# EAGLE design REV1 (EAGLE 7.5.0)

## Sheet 1 of 4: LEDs Schematic with all the LEDs (Type: WS2812B). There are two seperated data circuits DATA_In_1 and DATA_IN_2 which both have 30 LEDs series-connected.
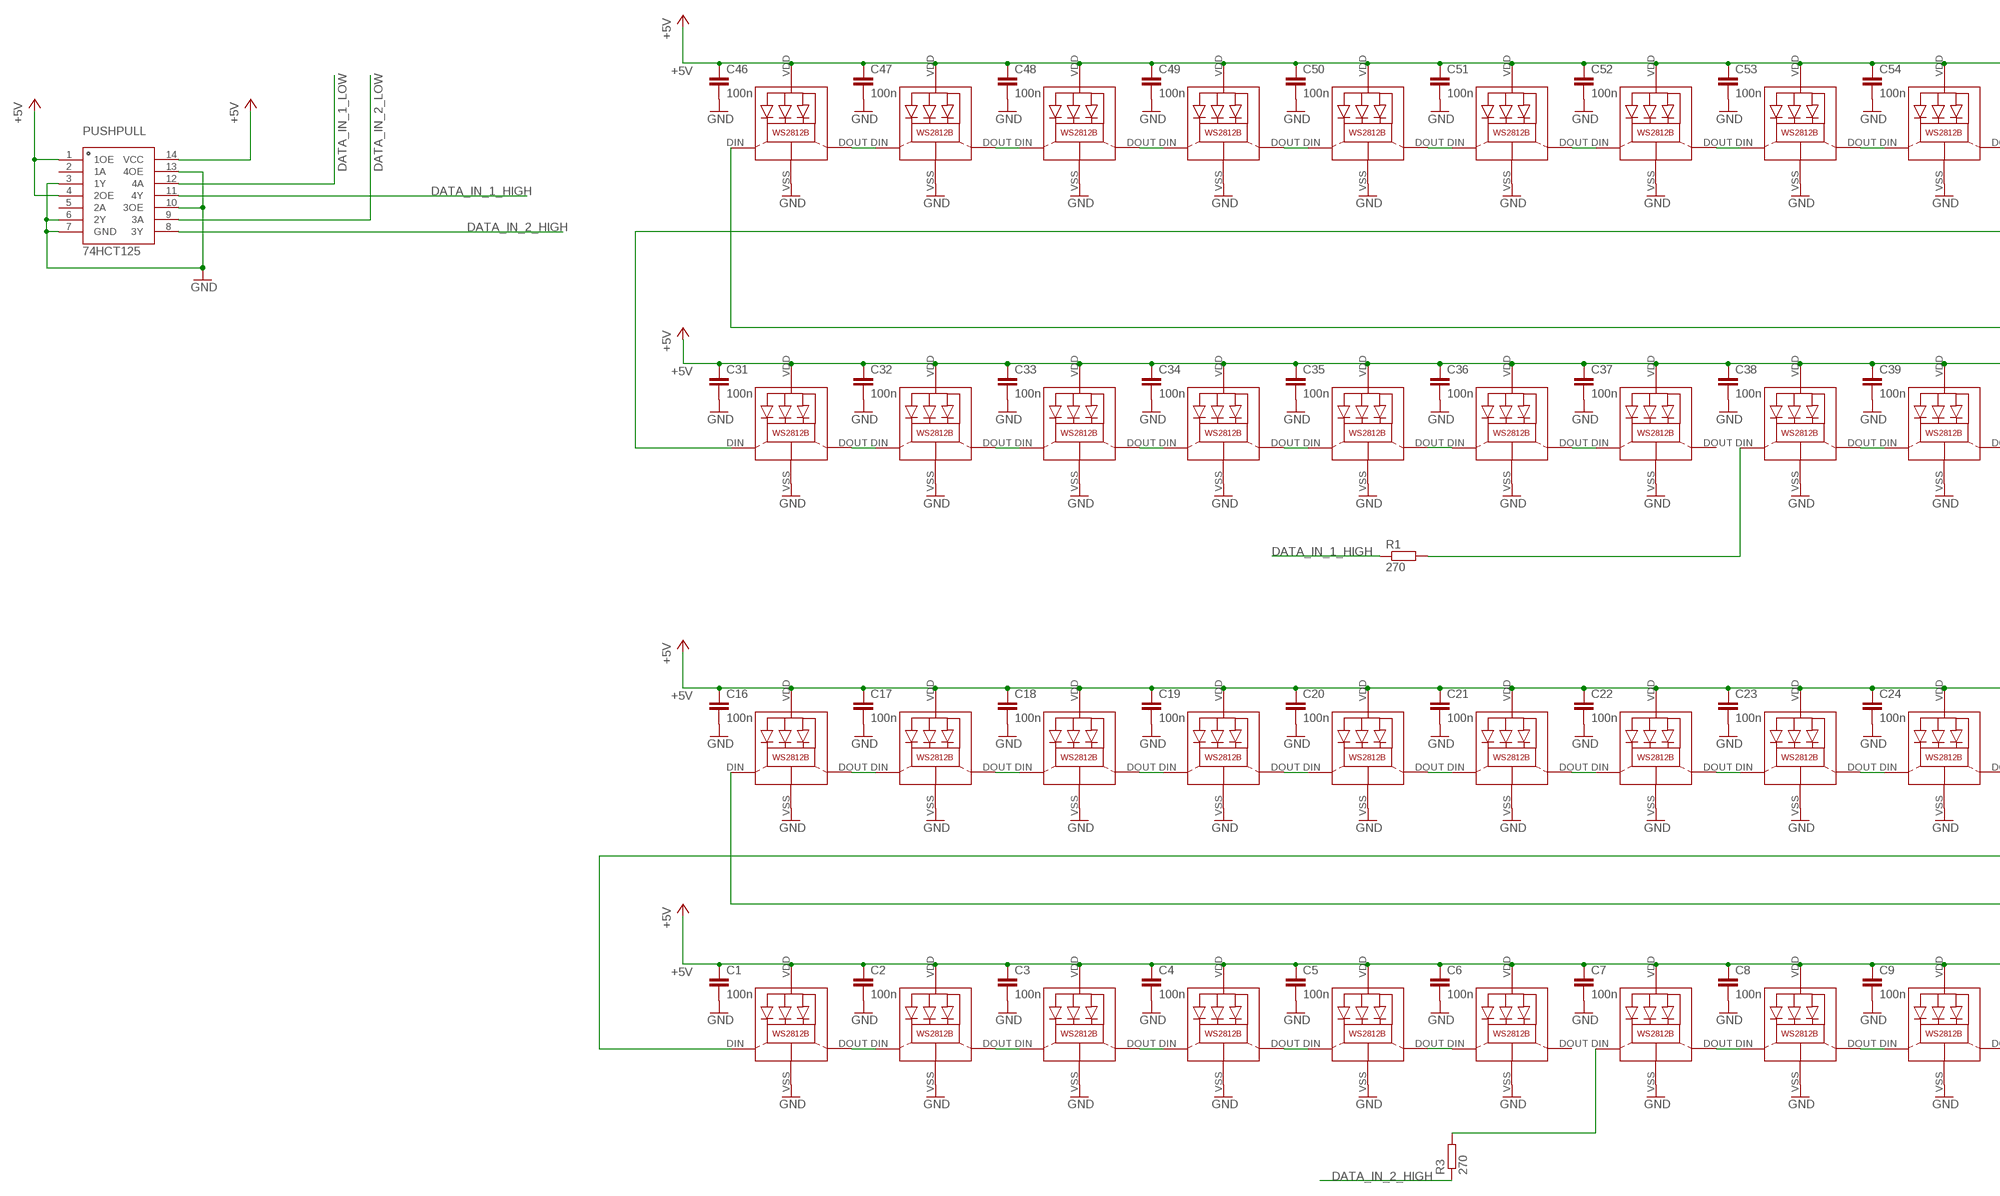
[diagram p0: schematic, sheet 1, part 1 of 2]
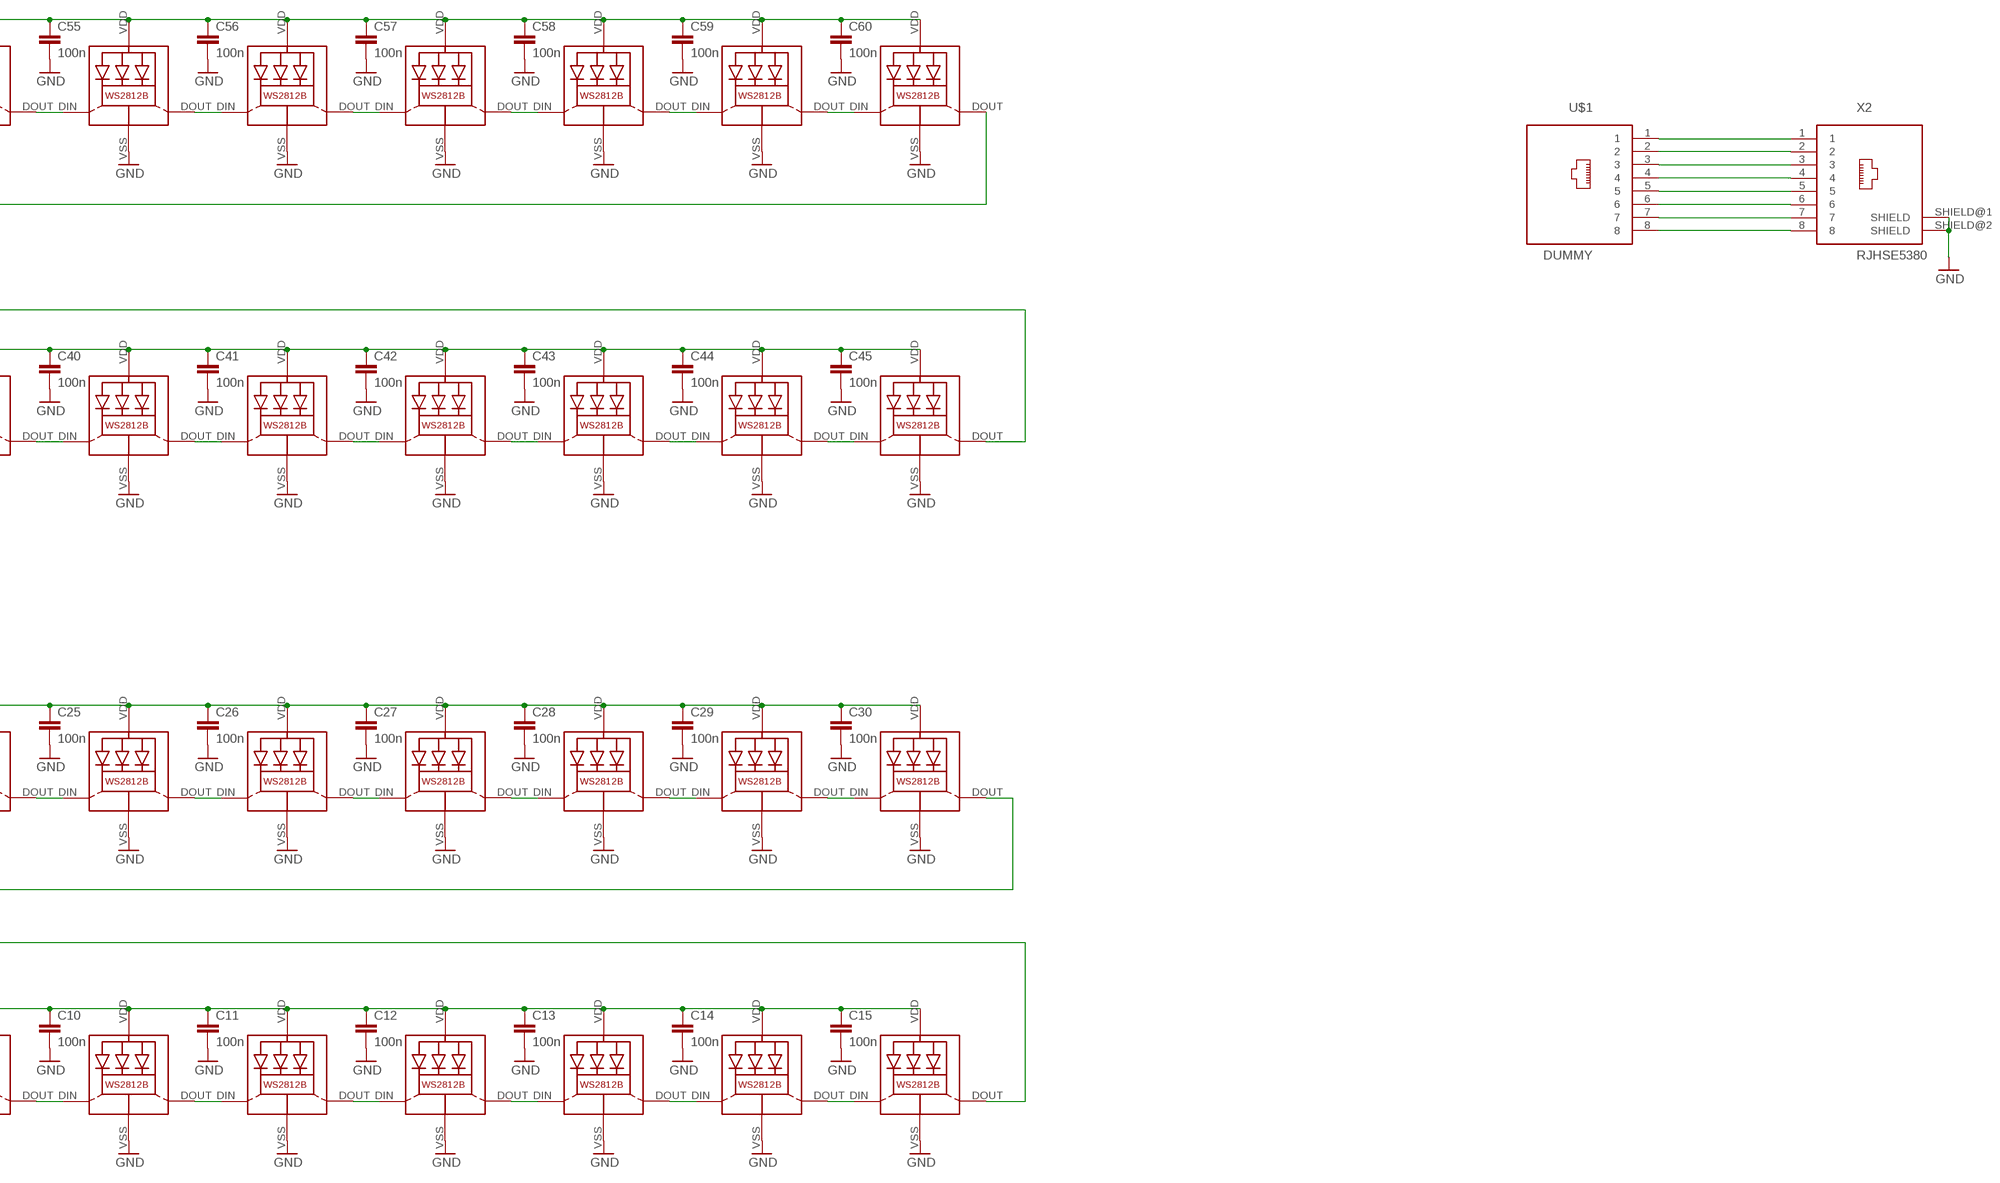
[diagram p1: schematic, sheet 1, part 2 of 2]

### Parts
C1  100n  C-EUC0603  [C0603]
C2  100n  C-EUC0603  [C0603]
C3  100n  C-EUC0603  [C0603]
C4  100n  C-EUC0603  [C0603]
C5  100n  C-EUC0603  [C0603]
C6  100n  C-EUC0603  [C0603]
C7  100n  C-EUC0603  [C0603]
C8  100n  C-EUC0603  [C0603]
C9  100n  C-EUC0603  [C0603]
C10  100n  C-EUC0603  [C0603]
C11  100n  C-EUC0603  [C0603]
C12  100n  C-EUC0603  [C0603]
C13  100n  C-EUC0603  [C0603]
C14  100n  C-EUC0603  [C0603]
C15  100n  C-EUC0603  [C0603]
C16  100n  C-EUC0603  [C0603]
C17  100n  C-EUC0603  [C0603]
C18  100n  C-EUC0603  [C0603]
C19  100n  C-EUC0603  [C0603]
C20  100n  C-EUC0603  [C0603]
C21  100n  C-EUC0603  [C0603]
C22  100n  C-EUC0603  [C0603]
C23  100n  C-EUC0603  [C0603]
C24  100n  C-EUC0603  [C0603]
C25  100n  C-EUC0603  [C0603]
C26  100n  C-EUC0603  [C0603]
C27  100n  C-EUC0603  [C0603]
C28  100n  C-EUC0603  [C0603]
C29  100n  C-EUC0603  [C0603]
C30  100n  C-EUC0603  [C0603]
C31  100n  C-EUC0603  [C0603]
C32  100n  C-EUC0603  [C0603]
C33  100n  C-EUC0603  [C0603]
C34  100n  C-EUC0603  [C0603]
C35  100n  C-EUC0603  [C0603]
C36  100n  C-EUC0603  [C0603]
C37  100n  C-EUC0603  [C0603]
C38  100n  C-EUC0603  [C0603]
C39  100n  C-EUC0603  [C0603]
C40  100n  C-EUC0603  [C0603]
C41  100n  C-EUC0603  [C0603]
C42  100n  C-EUC0603  [C0603]
C43  100n  C-EUC0603  [C0603]
C44  100n  C-EUC0603  [C0603]
C45  100n  C-EUC0603  [C0603]
C46  100n  C-EUC0603  [C0603]
C47  100n  C-EUC0603  [C0603]
C48  100n  C-EUC0603  [C0603]
C49  100n  C-EUC0603  [C0603]
C50  100n  C-EUC0603  [C0603]
C51  100n  C-EUC0603  [C0603]
C52  100n  C-EUC0603  [C0603]
C53  100n  C-EUC0603  [C0603]
C54  100n  C-EUC0603  [C0603]
C55  100n  C-EUC0603  [C0603]
C56  100n  C-EUC0603  [C0603]
C57  100n  C-EUC0603  [C0603]
C58  100n  C-EUC0603  [C0603]
C59  100n  C-EUC0603  [C0603]
C60  100n  C-EUC0603  [C0603]
LED1  WS2812B  [WS2812B]
LED2  WS2812B  [WS2812B]
LED3  WS2812B  [WS2812B]
LED4  WS2812B  [WS2812B]
LED5  WS2812B  [WS2812B]
LED6  WS2812B  [WS2812B]
LED7  WS2812B  [WS2812B]
LED8  WS2812B  [WS2812B]
LED9  WS2812B  [WS2812B]
LED10  WS2812B  [WS2812B]
LED11  WS2812B  [WS2812B]
LED12  WS2812B  [WS2812B]
LED13  WS2812B  [WS2812B]
LED14  WS2812B  [WS2812B]
LED15  WS2812B  [WS2812B]
LED16  WS2812B  [WS2812B]
LED17  WS2812B  [WS2812B]
LED18  WS2812B  [WS2812B]
LED19  WS2812B  [WS2812B]
LED20  WS2812B  [WS2812B]
LED21  WS2812B  [WS2812B]
LED22  WS2812B  [WS2812B]
LED23  WS2812B  [WS2812B]
LED24  WS2812B  [WS2812B]
LED25  WS2812B  [WS2812B]
LED26  WS2812B  [WS2812B]
LED27  WS2812B  [WS2812B]
LED28  WS2812B  [WS2812B]
LED29  WS2812B  [WS2812B]
LED30  WS2812B  [WS2812B]
LED31  WS2812B  [WS2812B]
LED32  WS2812B  [WS2812B]
LED33  WS2812B  [WS2812B]
LED34  WS2812B  [WS2812B]
LED35  WS2812B  [WS2812B]
LED36  WS2812B  [WS2812B]
LED37  WS2812B  [WS2812B]
LED38  WS2812B  [WS2812B]
LED39  WS2812B  [WS2812B]
LED40  WS2812B  [WS2812B]
LED41  WS2812B  [WS2812B]
LED42  WS2812B  [WS2812B]
LED43  WS2812B  [WS2812B]
LED44  WS2812B  [WS2812B]
LED45  WS2812B  [WS2812B]
LED46  WS2812B  [WS2812B]
LED47  WS2812B  [WS2812B]
LED48  WS2812B  [WS2812B]
LED49  WS2812B  [WS2812B]
LED50  WS2812B  [WS2812B]
LED51  WS2812B  [WS2812B]
LED52  WS2812B  [WS2812B]
LED53  WS2812B  [WS2812B]
LED54  WS2812B  [WS2812B]
LED55  WS2812B  [WS2812B]
LED56  WS2812B  [WS2812B]
LED57  WS2812B  [WS2812B]
LED58  WS2812B  [WS2812B]
LED59  WS2812B  [WS2812B]
LED60  WS2812B  [WS2812B]
PUSHPULL  74HCT125  [SO-14DW]
R1  270  R-EU_R0603  [R0603]
R3  270  R-EU_R0603  [R0603]
U$1  DUMMY  [DUMMY]
X2  RJHSE5380  [RJHSE5380]

### Nets
+5V: C1.1 C2.1 C3.1 C4.1 C5.1 C6.1 C7.1 C8.1 C9.1 C10.1 C11.1 C12.1 C13.1 C14.1 C15.1 C16.1 C17.1 C18.1 C19.1 C20.1 C21.1 C22.1 C23.1 C24.1 C25.1 C26.1 C27.1 C28.1 C29.1 C30.1 C31.1 C32.1 C33.1 C34.1 C35.1 C36.1 C37.1 C38.1 C39.1 C40.1 C41.1 C42.1 C43.1 C44.1 C45.1 C46.1 C47.1 C48.1 C49.1 C50.1 C51.1 C52.1 C53.1 C54.1 C55.1 C56.1 C57.1 C58.1 C59.1 C60.1 LED1.VDD LED2.VDD LED3.VDD LED4.VDD LED5.VDD LED6.VDD LED7.VDD LED8.VDD LED9.VDD LED10.VDD LED11.VDD LED12.VDD LED13.VDD LED14.VDD LED15.VDD LED16.VDD LED17.VDD LED18.VDD LED19.VDD LED20.VDD LED21.VDD LED22.VDD LED23.VDD LED24.VDD LED25.VDD LED26.VDD LED27.VDD LED28.VDD LED29.VDD LED30.VDD LED31.VDD LED32.VDD LED33.VDD LED34.VDD LED35.VDD LED36.VDD LED37.VDD LED38.VDD LED39.VDD LED40.VDD LED41.VDD LED42.VDD LED43.VDD LED44.VDD LED45.VDD LED46.VDD LED47.VDD LED48.VDD LED49.VDD LED50.VDD LED51.VDD LED52.VDD LED53.VDD LED54.VDD LED55.VDD LED56.VDD LED57.VDD LED58.VDD LED59.VDD LED60.VDD PUSHPULL.1(1OE) PUSHPULL.4(2OE) PUSHPULL.14(VCC) ; also sheet 2
DATA_IN_1_HIGH: PUSHPULL.11(4Y) R1.1
DATA_IN_1_LOW: PUSHPULL.12(4A) ; also sheet 3
DATA_IN_2_HIGH: PUSHPULL.8(3Y) R3.1
DATA_IN_2_LOW: PUSHPULL.9(3A) ; also sheet 3
GND: C1.2 C2.2 C3.2 C4.2 C5.2 C6.2 C7.2 C8.2 C9.2 C10.2 C11.2 C12.2 C13.2 C14.2 C15.2 C16.2 C17.2 C18.2 C19.2 C20.2 C21.2 C22.2 C23.2 C24.2 C25.2 C26.2 C27.2 C28.2 C29.2 C30.2 C31.2 C32.2 C33.2 C34.2 C35.2 C36.2 C37.2 C38.2 C39.2 C40.2 C41.2 C42.2 C43.2 C44.2 C45.2 C46.2 C47.2 C48.2 C49.2 C50.2 C51.2 C52.2 C53.2 C54.2 C55.2 C56.2 C57.2 C58.2 C59.2 C60.2 LED1.VSS(GND) LED2.VSS(GND) LED3.VSS(GND) LED4.VSS(GND) LED5.VSS(GND) LED6.VSS(GND) LED7.VSS(GND) LED8.VSS(GND) LED9.VSS(GND) LED10.VSS(GND) LED11.VSS(GND) LED12.VSS(GND) LED13.VSS(GND) LED14.VSS(GND) LED15.VSS(GND) LED16.VSS(GND) LED17.VSS(GND) LED18.VSS(GND) LED19.VSS(GND) LED20.VSS(GND) LED21.VSS(GND) LED22.VSS(GND) LED23.VSS(GND) LED24.VSS(GND) LED25.VSS(GND) LED26.VSS(GND) LED27.VSS(GND) LED28.VSS(GND) LED29.VSS(GND) LED30.VSS(GND) LED31.VSS(GND) LED32.VSS(GND) LED33.VSS(GND) LED34.VSS(GND) LED35.VSS(GND) LED36.VSS(GND) LED37.VSS(GND) LED38.VSS(GND) LED39.VSS(GND) LED40.VSS(GND) LED41.VSS(GND) LED42.VSS(GND) LED43.VSS(GND) LED44.VSS(GND) LED45.VSS(GND) LED46.VSS(GND) LED47.VSS(GND) LED48.VSS(GND) LED49.VSS(GND) LED50.VSS(GND) LED51.VSS(GND) LED52.VSS(GND) LED53.VSS(GND) LED54.VSS(GND) LED55.VSS(GND) LED56.VSS(GND) LED57.VSS(GND) LED58.VSS(GND) LED59.VSS(GND) LED60.VSS(GND) PUSHPULL.3(1Y) PUSHPULL.6(2Y) PUSHPULL.7(GND) PUSHPULL.10(3OE) PUSHPULL.13(4OE) X2.SHIELD@1(SHIELD) X2.SHIELD@2(SHIELD) ; also sheet 2,3,4
N$1: LED45.DOUT(DO) LED46.DIN(DI)
N$2: LED46.DOUT(DO) LED47.DIN(DI)
N$3: LED47.DOUT(DO) LED48.DIN(DI)
N$4: LED48.DOUT(DO) LED49.DIN(DI)
N$5: LED49.DOUT(DO) LED50.DIN(DI)
N$6: LED50.DOUT(DO) LED51.DIN(DI)
N$7: LED51.DOUT(DO) LED52.DIN(DI)
N$8: LED52.DOUT(DO) LED53.DIN(DI)
N$9: LED53.DOUT(DO) LED54.DIN(DI)
N$10: LED54.DOUT(DO) LED55.DIN(DI)
N$11: LED55.DOUT(DO) LED56.DIN(DI)
N$12: LED56.DOUT(DO) LED57.DIN(DI)
N$13: LED57.DOUT(DO) LED58.DIN(DI)
N$14: LED58.DOUT(DO) LED59.DIN(DI)
N$15: LED59.DOUT(DO) LED60.DIN(DI)
N$16: LED31.DIN(DI) LED60.DOUT(DO)
N$17: LED1.DIN(DI) LED30.DOUT(DO)
N$18: LED1.DOUT(DO) LED2.DIN(DI)
N$19: LED2.DOUT(DO) LED3.DIN(DI)
N$20: LED3.DOUT(DO) LED4.DIN(DI)
N$21: LED4.DOUT(DO) LED5.DIN(DI)
N$22: LED7.DIN(DI) R3.2
N$23: LED5.DOUT(DO) LED6.DIN(DI)
N$24: LED7.DOUT(DO) LED8.DIN(DI)
N$25: LED8.DOUT(DO) LED9.DIN(DI)
N$26: LED9.DOUT(DO) LED10.DIN(DI)
N$27: LED10.DOUT(DO) LED11.DIN(DI)
N$28: LED11.DOUT(DO) LED12.DIN(DI)
N$29: LED12.DOUT(DO) LED13.DIN(DI)
N$30: LED13.DOUT(DO) LED14.DIN(DI)
N$31: LED14.DOUT(DO) LED15.DIN(DI)
N$32: LED15.DOUT(DO) LED16.DIN(DI)
N$33: LED16.DOUT(DO) LED17.DIN(DI)
N$34: LED17.DOUT(DO) LED18.DIN(DI)
N$35: LED18.DOUT(DO) LED19.DIN(DI)
N$36: LED19.DOUT(DO) LED20.DIN(DI)
N$37: LED20.DOUT(DO) LED21.DIN(DI)
N$38: LED21.DOUT(DO) LED22.DIN(DI)
N$39: LED22.DOUT(DO) LED23.DIN(DI)
N$40: LED23.DOUT(DO) LED24.DIN(DI)
N$41: LED24.DOUT(DO) LED25.DIN(DI)
N$42: LED25.DOUT(DO) LED26.DIN(DI)
N$43: LED26.DOUT(DO) LED27.DIN(DI)
N$44: LED27.DOUT(DO) LED28.DIN(DI)
N$45: LED28.DOUT(DO) LED29.DIN(DI)
N$46: LED29.DOUT(DO) LED30.DIN(DI)
N$47: LED38.DIN(DI) R1.2
N$48: LED31.DOUT(DO) LED32.DIN(DI)
N$49: LED32.DOUT(DO) LED33.DIN(DI)
N$50: LED33.DOUT(DO) LED34.DIN(DI)
N$51: LED34.DOUT(DO) LED35.DIN(DI)
N$52: LED35.DOUT(DO) LED36.DIN(DI)
N$53: LED36.DOUT(DO) LED37.DIN(DI)
N$54: U$1.1 X2.1
N$55: LED38.DOUT(DO) LED39.DIN(DI)
N$56: LED39.DOUT(DO) LED40.DIN(DI)
N$57: LED40.DOUT(DO) LED41.DIN(DI)
N$58: LED41.DOUT(DO) LED42.DIN(DI)
N$59: LED42.DOUT(DO) LED43.DIN(DI)
N$60: LED43.DOUT(DO) LED44.DIN(DI)
N$61: LED44.DOUT(DO) LED45.DIN(DI)
N$62: U$1.2 X2.2
N$64: U$1.3 X2.3
N$70: U$1.4 X2.4
N$73: U$1.5 X2.5
N$74: U$1.6 X2.6
N$75: U$1.7 X2.7
N$79: U$1.8 X2.8
Unconnected: LED6.DOUT(DO) LED37.DOUT(DO) PUSHPULL.2(1A) PUSHPULL.5(2A)

## Sheet 2 of 4: Power Management Power Management with LTC4412 for auto selection of USB supply or external power supply. LTC4412 controls two mosfets. Diode for overvoltage protection of the USB port.
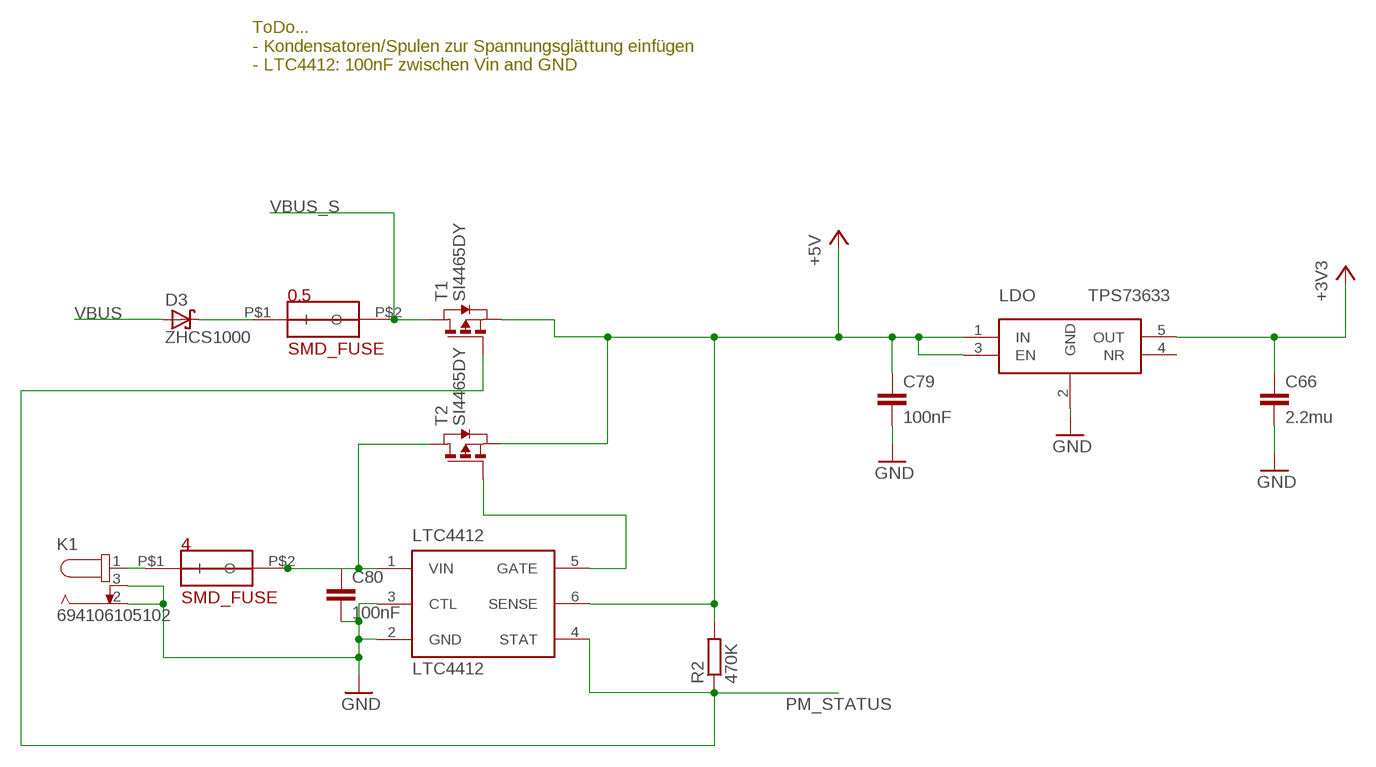
[diagram p2: schematic, sheet 2]

### Parts
0.5  SMD_FUSE  [FUSE]
4  SMD_FUSE  [FUSE]
C66  2.2mu  C-EUC0603  [C0603]
C79  100nF  C-EUC0603  [C0603]
C80  100nF  C-EUC0603  [C0603]
D3  ZHCS1000  [SOT23]
K1  694106105102  [694106105102]
LDO  TPS73633  [SOT23-DBV]
LTC4412  LTC4412  [SOT23-6L]
R2  470K  R-EU_R0603  [R0603]
T1  SI4465DY  PMOSSOT223SO8  [SO08]
T2  SI4465DY  PMOSSOT223SO8  [SO08]

### Nets
+3V3: C66.1 LDO.5(OUT) ; also sheet 3
+5V: C79.1 LDO.1(IN) LDO.3(EN) LTC4412.6(SENSE) R2.2 T1.1(S) T1.2(S) T1.3(S) T2.1(S) T2.2(S) T2.3(S) ; also sheet 1
GND: C66.2 C79.2 C80.2 K1.2 K1.3 LDO.2(GND) LTC4412.2(GND) LTC4412.3(CTL) ; also sheet 1,3,4
N$63: LTC4412.5(GATE) T2.4(G)
N$69: 0.5.P$1(I) D3.1(C)
PM_STATUS: LTC4412.4(STAT) R2.1 T1.4(G) ; also sheet 3
V_5: 4.P$2(O) C80.1 LTC4412.1(VIN) T2.5(D) T2.6(D) T2.7(D) T2.8(D)
V_IN: 4.P$1(I) K1.1
VBUS: D3.3(A) ; also sheet 4
VBUS_S: 0.5.P$2(O) T1.5(D) T1.6(D) T1.7(D) T1.8(D) ; also sheet 4
Unconnected: LDO.4(NR)

### Notes on the sheet
- ToDo...
  - Kondensatoren/Spulen zur Spannungsglättung einfügen
  - LTC4412: 100nF zwischen Vin and GND

## Sheet 3 of 4: MCU A STM32745VE is used as a microcontroller
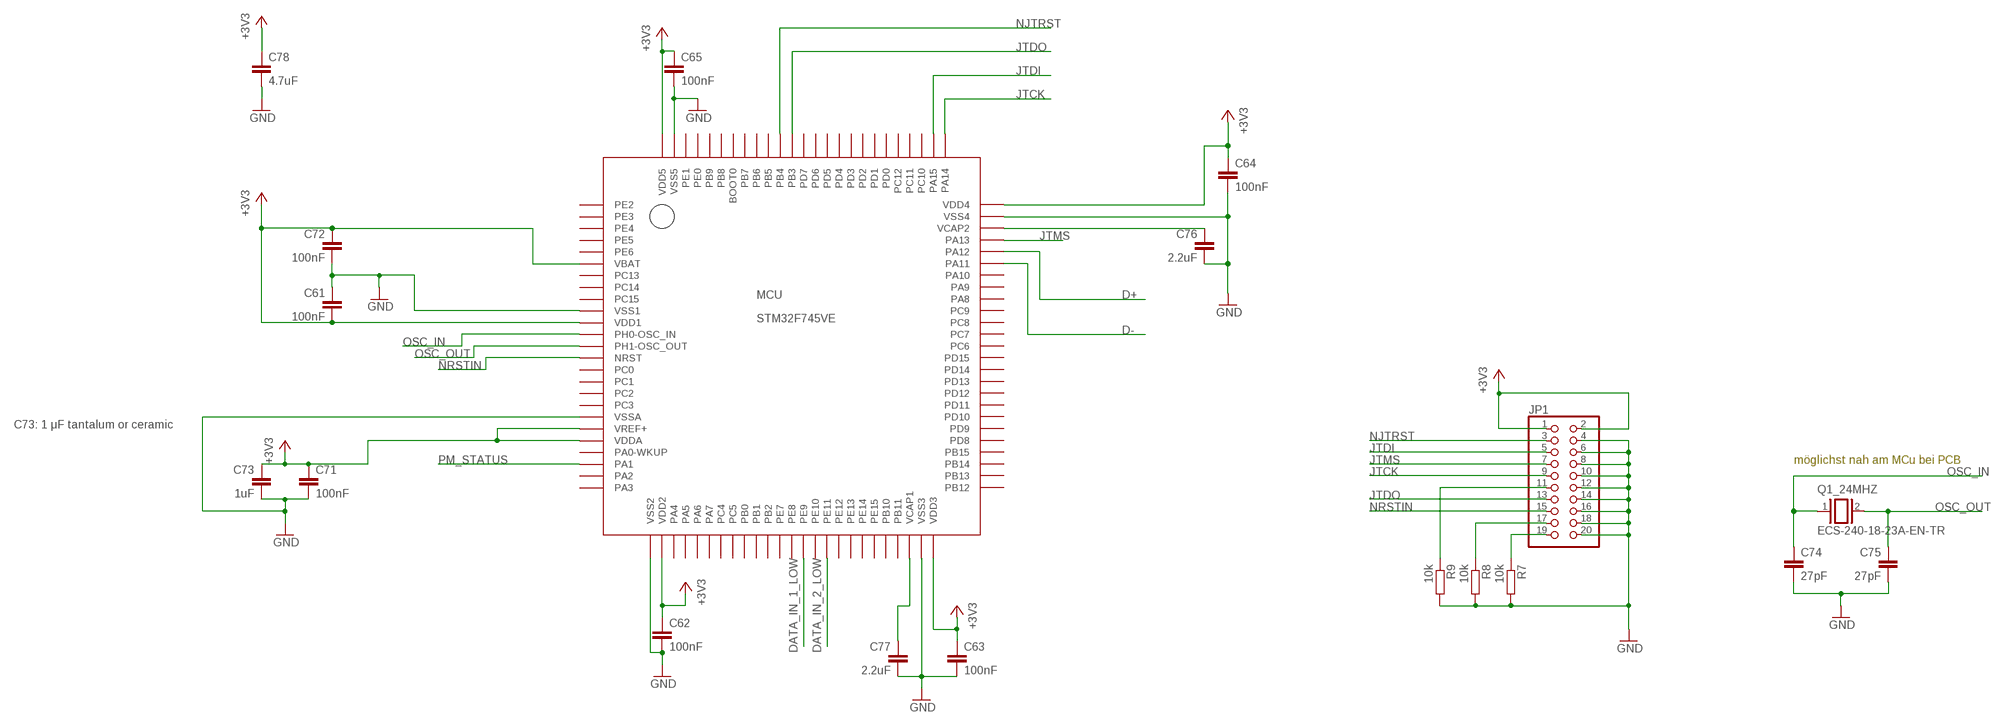
[diagram p3: schematic, sheet 3]

### Parts
C61  100nF  C-EUC0603  [C0603]
C62  100nF  C-EUC0603  [C0603]
C63  100nF  C-EUC0603  [C0603]
C64  100nF  C-EUC0603  [C0603]
C65  100nF  C-EUC0603  [C0603]
C71  100nF  C-EUC0603  [C0603]
C72  100nF  C-EUC0603  [C0603]
C73  1uF  C-EUC0603  [C0603]
C74  27pF  C-EUC0603  [C0603]
C75  27pF  C-EUC0603  [C0603]
C76  2.2uF  C-EUC0603  [C0603]
C77  2.2uF  C-EUC0603  [C0603]
C78  4.7uF  C-EUC0603  [C0603]
JP1  PINHD-2X10_2.54-SMD  [2X10SMD]
MCU  STM32F745VE  [LQFP100]
Q1_24MHZ  ECS-240-18-23A-EN-TR  ECX64A  [ESC64A]
R7  10k  R-EU_R0603  [R0603]
R8  10k  R-EU_R0603  [R0603]
R9  10k  R-EU_R0603  [R0603]

### Nets
+3V3: C61.2 C62.1 C63.1 C64.1 C65.1 C71.1 C72.1 C73.1 C78.1 JP1.1 JP1.2 MCU.6(VBAT) MCU.11(VDD1) MCU.20(VREF+) MCU.21(VDDA) MCU.27(VDD2) MCU.50(VDD3) MCU.75(VDD4) MCU.100(VDD5) ; also sheet 2
D+: MCU.71(PA12) ; also sheet 4
D-: MCU.70(PA11) ; also sheet 4
DATA_IN_1_LOW: MCU.39(PE9) ; also sheet 1
DATA_IN_2_LOW: MCU.41(PE11) ; also sheet 1
GND: C61.1 C62.2 C63.2 C64.2 C65.2 C71.2 C72.2 C73.2 C74.2 C75.2 C76.2 C77.2 C78.2 JP1.4 JP1.6 JP1.8 JP1.10 JP1.12 JP1.14 JP1.16 JP1.18 JP1.20 MCU.10(VSS1) MCU.19(VSSA) MCU.26(VSS2) MCU.49(VSS3) MCU.74(VSS4) MCU.99(VSS5) R7.2 R8.2 R9.2 ; also sheet 1,2,4
JTCK: JP1.9 MCU.76(PA14)
JTDI: JP1.5 MCU.77(PA15)
JTDO: JP1.13 MCU.89(PB3)
JTMS: JP1.7 MCU.72(PA13)
N$71: C77.1 MCU.48(VCAP1)
N$72: C76.1 MCU.73(VCAP2)
N$76: JP1.19 R7.1
N$77: JP1.17 R8.1
N$78: JP1.11 R9.1
NJTRST: JP1.3 MCU.90(PB4)
NRSTIN: JP1.15 MCU.14(NRST)
OSC_IN: C74.1 MCU.12(PH0-OSC_IN) Q1_24MHZ.1
OSC_OUT: C75.1 MCU.13(PH1-OSC_OUT) Q1_24MHZ.2
PM_STATUS: MCU.23(PA1) ; also sheet 2
Unconnected: MCU.1(PE2) MCU.2(PE3) MCU.3(PE4) MCU.4(PE5) MCU.5(PE6) MCU.7(PC13) MCU.8(PC14) MCU.9(PC15) MCU.15(PC0) MCU.16(PC1) MCU.17(PC2) MCU.18(PC3) MCU.22(PA0-WKUP) MCU.24(PA2) MCU.25(PA3) MCU.28(PA4) MCU.29(PA5) MCU.30(PA6) MCU.31(PA7) MCU.32(PC4) MCU.33(PC5) MCU.34(PB0) MCU.35(PB1) MCU.36(PB2) MCU.37(PE7) MCU.38(PE8) MCU.40(PE10) MCU.42(PE12) MCU.43(PE13) MCU.44(PE14) MCU.45(PE15) MCU.46(PB10) MCU.47(PB11) MCU.51(PB12) MCU.52(PB13) MCU.53(PB14) MCU.54(PB15) MCU.55(PD8) MCU.56(PD9) MCU.57(PD10) MCU.58(PD11) MCU.59(PD12) MCU.60(PD13) MCU.61(PD14) MCU.62(PD15) MCU.63(PC6) MCU.64(PC7) MCU.65(PC8) MCU.66(PC9) MCU.67(PA8) MCU.68(PA9) MCU.69(PA10) MCU.78(PC10) MCU.79(PC11) MCU.80(PC12) MCU.81(PD0) MCU.82(PD1) MCU.83(PD2) MCU.84(PD3) MCU.85(PD4) MCU.86(PD5) MCU.87(PD6) MCU.88(PD7) MCU.91(PB5) MCU.92(PB6) MCU.93(PB7) MCU.94(BOOT0) MCU.95(PB8) MCU.96(PB9) MCU.97(PE0) MCU.98(PE1)

### Notes on the sheet
- C73: 1 μF tantalum or ceramic
- möglichst nah am MCu bei PCB

## Sheet 4 of 4: USB USB-Connection
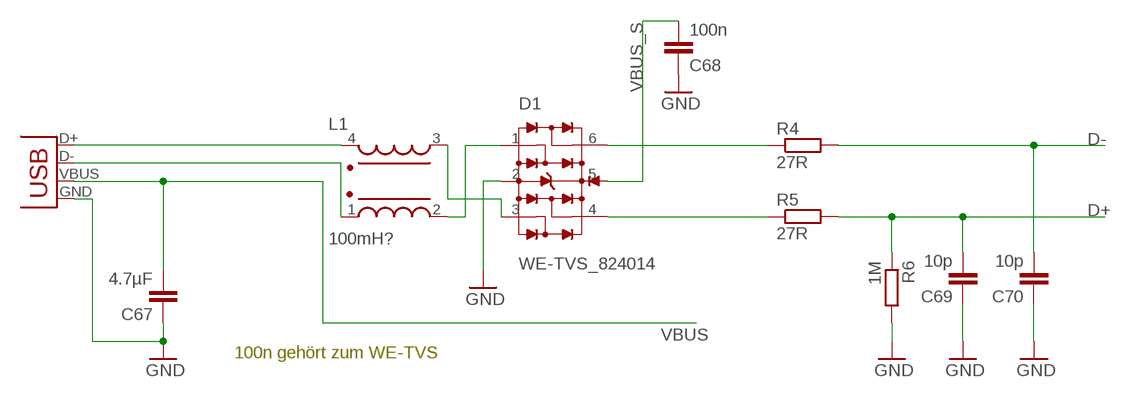
[diagram p4: schematic, sheet 4]

### Parts
C67  4.7µF  C-EUC0603  [C0603]
C68  100n  C-EUC0603  [C0603]
C69  10p  C-EUC0603  [C0603]
C70  10p  C-EUC0603  [C0603]
D1  WE-TVS_824014  [WE-TVS_SOT23-6L]
L1  100mH?  WE-CNSW_0805  [WE-CNSW_0805]
R4  27R  R-EU_R0603  [R0603]
R5  27R  R-EU_R0603  [R0603]
R6  1M  R-EU_R0603  [R0603]
X1  USBSMD  [USB-MINIB]

### Nets
D+: C69.2 R5.2 R6.1 ; also sheet 3
D+_TMP: L1.4 X1.D+
D-: C70.2 R4.2 ; also sheet 3
D-_TMP: L1.1 X1.D-
GND: C67.1 C68.1 C69.1 C70.1 D1.2(GND) R6.2 X1.GND ; also sheet 1,2,3
N$65: D1.1 L1.2
N$66: D1.3 L1.3
N$67: D1.6 R4.1
N$68: D1.4 R5.1
VBUS: C67.2 X1.VBUS ; also sheet 2
VBUS_S: C68.2 D1.5(VDD) ; also sheet 2

### Notes on the sheet
- 100n gehört zum WE-TVS

## Library data of the parts
0.5 4 = ownLib:SMD_FUSE
C1-C80 = rcl:C-EU: CAPACITOR, European symbol
D1 = Wurth_Elektronik_EMC_COMPONENTS_rev16c:WE-TVS_824014: TVS Diode Super Speed Series Characteristics Operating temperature: –55 ºC to +85 °C for 824 014 x; –40 ºC to +85 °C for 824 016 46 Low clamping voltage Very low capacitance Rail to Rail protection Epoxy flame resistant UL94 V-0 RoHS, REACH and free of halogens Applications Super Speed data lines HDMI 1.3/1.4, DVI DisplayPort USB 3.0 SuperSpeed SATA GBit LAN ESD protection in accordance with EN 61000-4-2 – 8 kV contact discharge – 15 kV air discharge <http://katalog.we-online.de/media/images/eisos/VarTVS_highspeed_pf2.jpg.jpg> Details see: http://katalog.we-online.de/en/pbs/WE-TVS_High_Speed/24014? Updated by Dan Xu 2014-07-11 2014 (C) Wurth Elektronik
D3 = ownLib:ZHCS1000: Silicon Schottky Diodes General-purpose diode for high-speed switching
JP1 = pinhead:PINHD-2X10: PIN HEADER
K1 = Wurth_Elektronik_Electromechanic_DC_Power_Jack_Connectors_rev15c:694106105102: WR-DC_DC Power Jack_Right Angled_SMT Center Pin Ø2.0_Plug ID Ø2.05_Plug OD Ø5.5_with Peg ;=>Code : Con_WR-DC_SMT_694106105102_694106105102 <http://katalog.we-online.de/media/images/eican/Con_WR-DC_SMT_694106105102_pf2.jpg> Details see: http://katalog.we-online.de/em/datasheet/6941xx105102.pdf Created 2014-10-08, Karrer Zheng 2014 (C) Wurth Elektronik
L1 = Wurth_Elektronik_EMC_COMPONENTS_rev16c:WE-CNSW: WE-CNSW SMD Common Mode Line Filter Characteristics High common mode noise suppression at high frequencies Small influence on high speed signals through winding symmetry Operating temperature: –40 ºC to +125 ºC (Size 0805/1206/1812); –40 ºC to +105 ºC (Size 0603) Applications USB 2.0 IEEE 1394 (Firewire) LVDS High Speed Data Lines LAN <http://katalog.we-online.de/media/images/eisos/IndCNSW_pf2.jpg> Details see: http://katalog.we-online.de/en/pbs/WE-CNSW Updated by Dan Xu 2014-06-30 2014 (C) Wurth Elektronik
LDO = TPS73633:TPS73633
LED1-LED60 = WS2812B:WS2812B: Features and Benefits  * Intelligent reverse connect protection, the power supply reverse connection does not damage the IC. * The control circuit and the LED share the only power source. Control circuit and RGB chip are integrated in a package of 5050 components, form a complete control of pixel point.  * Built-in signal reshaping circuit, after wave reshaping to the next driver, ensure wave-form distortion not accumulate.  * Built-in electric reset circuit and power lost reset circuit.  * Each pixel of the three primary color can achieve 256 brightness display, completed 16777216 color full color display, and scan frequency not less than 400Hz/s.  * Cascading port transmission signal by single line.  * Any two point the distance more than 5m transmission signal without any increase circuit.  * When the refresh rate is 30fps, cascade number are not less than1024 points.  * Send data at speeds of 800Kbps.  *The color of the light were highly consistent, cost-effective. Applications  Full-color module, Full color soft lights a lamp strip. LED decorative lighting, Indoor/outdoor LED video irregular screen. General description WS2812B is a intelligent control LED light source that the control circuit and RGB chip are integrated in a package of 5050 components. It internal include intelligent digital port data latch and signal reshaping amplification drive circuit. Also include a precision internal oscillator and a 12V voltage programmable constant curre-nt control part, effectively ensuring the pixel point light color height consistent. The data transfer protocol use single NZR communication mode. After the pixel power-on reset, the DIN port receive data from controller, the first pixel collect initial 24bit data then sent to the internal data latch, the other data which reshaping by the internal signal reshaping amplification circuit sent to the next cascade pixel through the DO port. After transmission for each pixel,the signal to reduce 24bit. pixel adopt auto reshaping transmit technology, making the pixel cascade number is not limited the signal transmission, only depend on the speed of signal transmission. LED with low driving voltage, environmental protection and energy saving, high brightness, scattering angle is large, good consistency, low power, long life and other advantages. The control chip integrated in LED above becoming more simple circuit, small volume, convenient installation. Absolute Maximum Ratings Power supply voltage: VDD +3.5V..+5.3V Input voltage: VI -0.5V..VDD+0.5V based on WS2812 from https://github.com/adafruit/Adafruit-Eagle-Library
LTC4412 = LTC4412:LTC4412
MCU = STM32F745VE_LQFP100:STM32F745VE
PUSHPULL = 74HCT125:74HCT125
Q1_24MHZ = Crystal:ECX64A: CRYSTAL
R1-R9 = rcl:R-EU_: RESISTOR, European symbol
T1 T2 = ownLib:PMOSSOT223: MOS FET
U$1 = lan_connector:DUMMY
X1 = usb:USB: USB Connectors USB-B-PTH is fully proven SKU : PRT-00139 USB-miniB is fully proven SKU : PRT-00587 USB-A-PCB is untested. USB-A-H is throughly reviewed, but untested. Spark Fun Electronics SKU : PRT-00437 USB-B-SMT is throughly reviewed, but untested. Needs silkscreen touching up. USB-A-S has not been used/tested USB-MB-H has not been used/tested
X2 = lan_connector:RJHSE5380

## Board
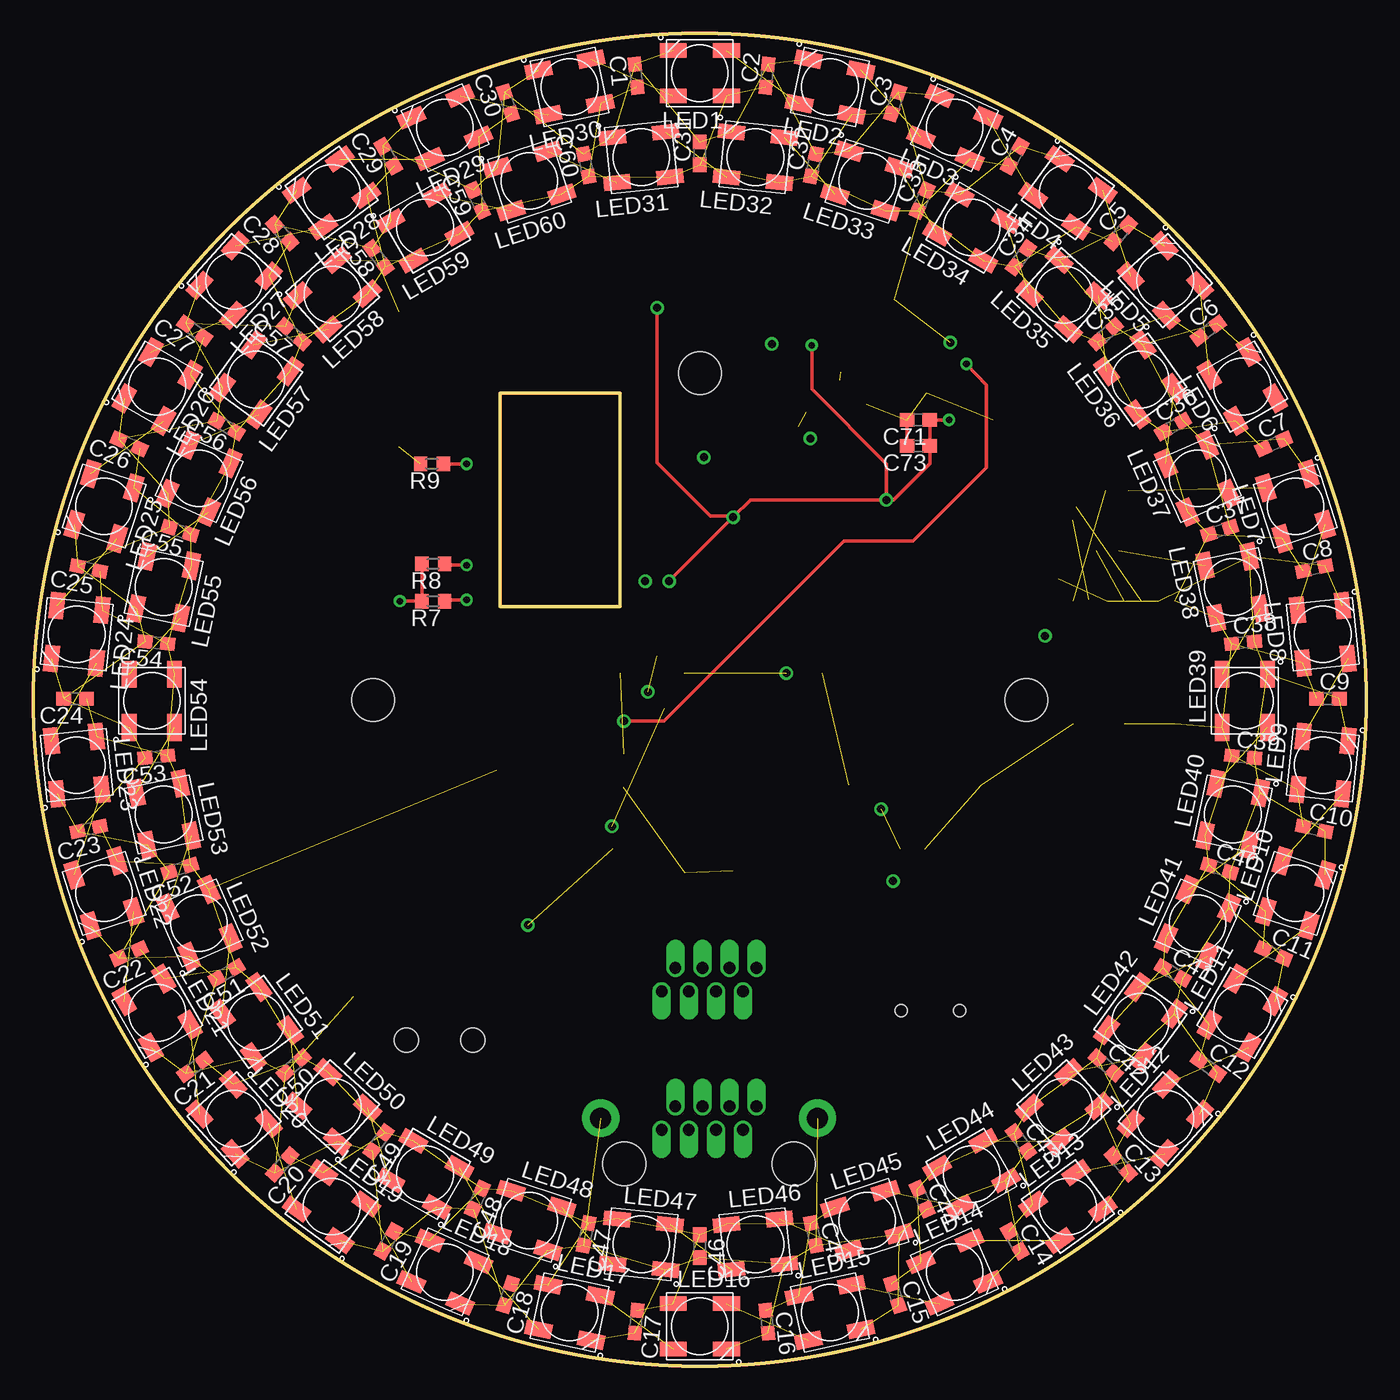
[diagram p5: board, top side]
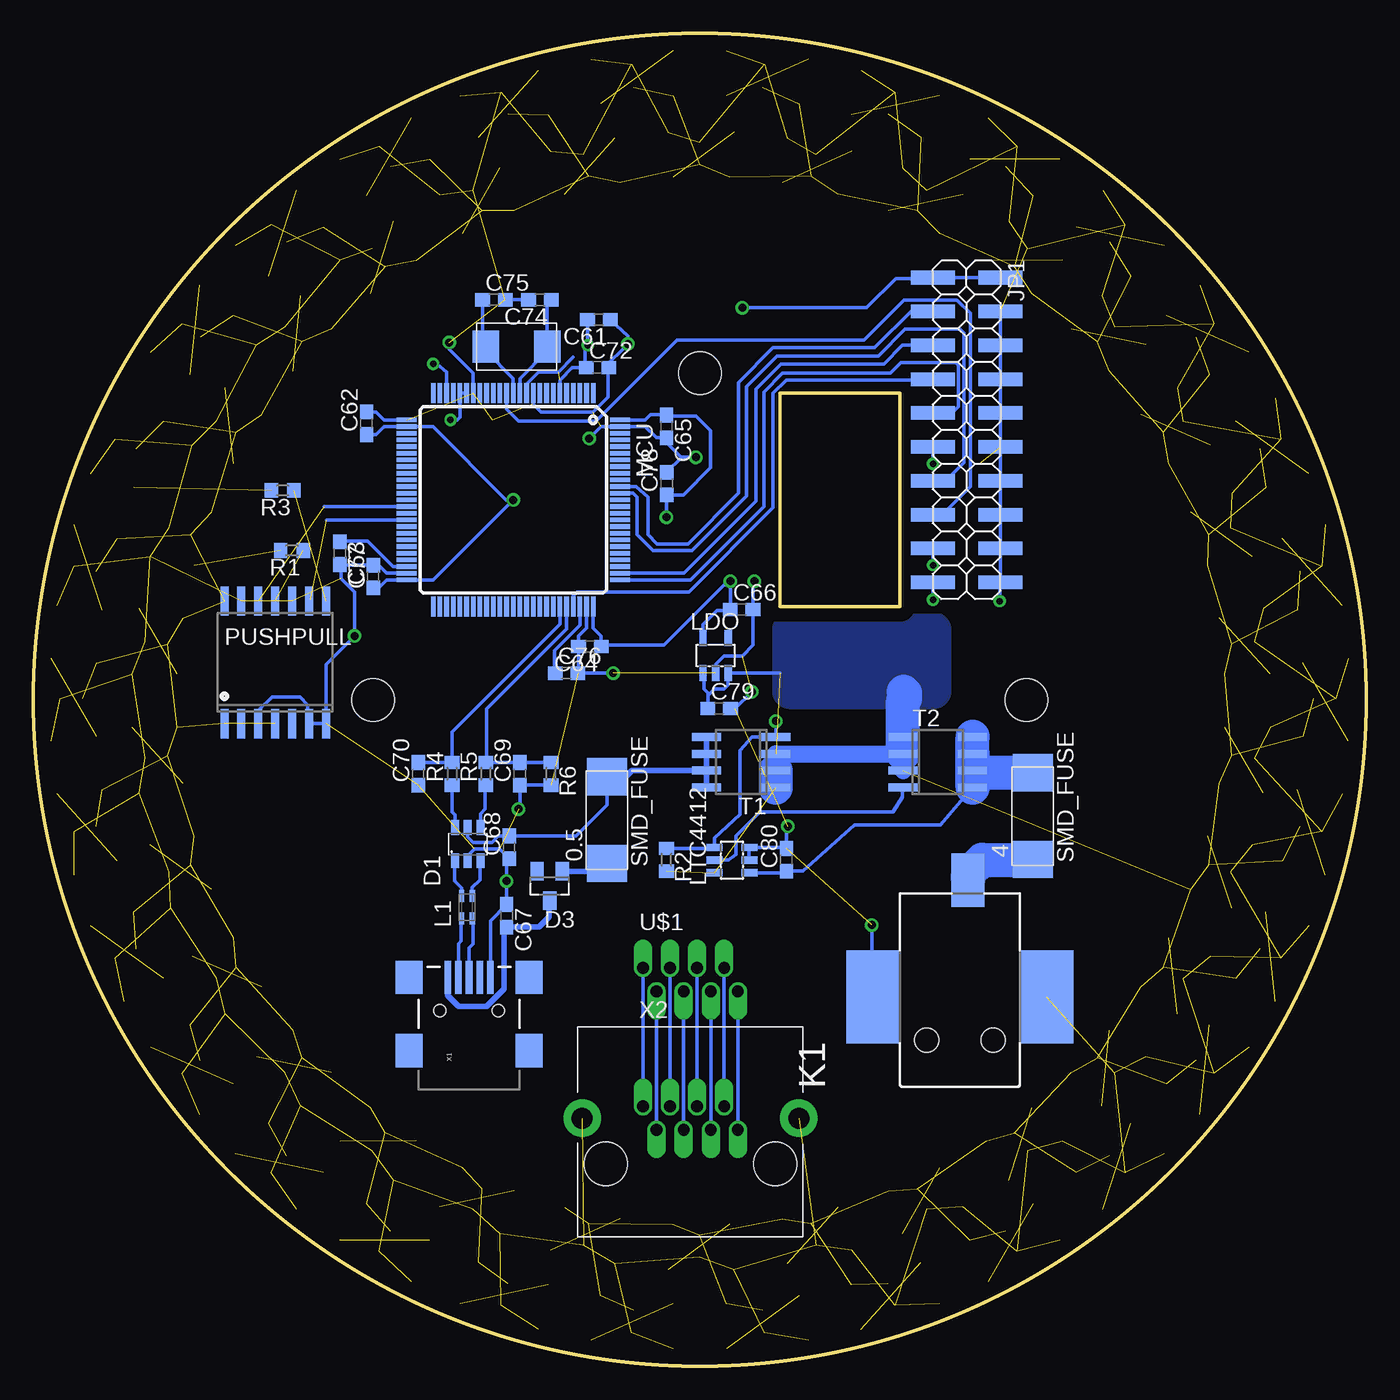
[diagram p6: board, bottom side, seen from below]

Size 100 x 100 mm. Coordinates in mm from the lower left corner, seen from the top.
Outline: 35,73 35,57 44,57 44,73 35,73
Outline: circle at 50,50 radius 50
Copper layers (1*16): Top 0.035mm / dielectric 1.5mm / Bottom 0.035mm
Design rules "default": minimum track width 10mil, minimum drill 24mil, track to track 8mil, track to pad 8mil, pad to pad 8mil, via to via 8mil, smd to smd 8mil, copper to edge 40mil, drill to drill 8mil, minimum pad ring 10mil, minimum via ring 8mil, stop-mask expansion 4mil, vias tented up to drill 0mil, thermal gap 10mil
Holes 3.2 mm at 25.5,50 74.5,50 50,74.5
tKeepout: area 21,21 to 79,79

### Footprints (pad centres in the part's own frame; a part is rotated, then mirrored left to right if it is on the bottom)
FUSE = smd 2.8 x 3: P$1 -3.25,0; P$2 3.25,0
C0603 = smd 1.1 x 1: 1 -0.85,0; 2 0.85,0
WE-TVS_SOT23-6L = smd 0.6 x 1.1: 1 -0.95,-1.25; 2 0,-1.25; 3 0.95,-1.25; 4 0.95,1.25; 5 0,1.25; 6 -0.95,1.25
SOT23 = smd 1 x 1.4: 1 -0.95,-1.1; 2 0.95,-1.1; 3 0,1.1
2X10SMD = smd 1.016 x 3.302: 1 -1.27,-3.81; 2 -1.27,1.27; 3 1.27,-3.81; 4 1.27,1.27; 5 3.81,-3.81; 6 3.81,1.27; 7 6.35,-3.81; 8 6.35,1.27; 9 8.89,-3.81; 10 8.89,1.27; 11 11.43,-3.81; 12 11.43,1.27; 13 13.97,-3.81; 14 13.97,1.27; 15 16.51,-3.81; 16 16.51,1.27; 17 19.05,-3.81; 18 19.05,1.27; 19 21.59,-3.81; 20 21.59,1.27
694106105102 = smd 4 x 2.5: 1 15.5,-0.6 | smd 7 x 4: 2 6.75,6.5; 3 6.75,-6.5 | hole 1.8: 3.5,2.5; 3.5,-2.5
WE-CNSW_0805 = smd 0.9 x 0.4: 1 0.85,-0.4; 2 -0.85,-0.4; 3 -0.85,0.4; 4 0.85,0.4
SOT23-DBV = smd 0.55 x 1.2: 1 -0.95,-1.3; 2 0,-1.3; 3 0.95,-1.3; 4 0.95,1.3; 5 -0.95,1.3
WS2812B = smd 2 x 1.1: DIN 2,1.7; DOUT -2,-1.7; VDD -2,1.7; VSS 2,-1.7
SOT23-6L = smd 0.55 x 1.2: 1 -0.95,-1.3; 2 0,-1.3; 3 0.95,-1.3; 4 0.95,1.3; 5 0,1.3; 6 -0.95,1.3
LQFP100 = smd 1.5 x 0.35: 1 -8,6; 2 -8,5.5; 3 -8,5; 4 -8,4.5; 5 -8,4; 6 -8,3.5; 7 -8,3; 8 -8,2.5; 9 -8,2; 10 -8,1.5; 11 -8,1; 12 -8,0.5; 13 -8,0; 14 -8,-0.5; 15 -8,-1; 16 -8,-1.5; 17 -8,-2; 18 -8,-2.5; 19 -8,-3; 20 -8,-3.5; 21 -8,-4; 22 -8,-4.5; 23 -8,-5; 24 -8,-5.5; 25 -8,-6; 51 8,-6; 52 8,-5.5; 53 8,-5; 54 8,-4.5; 55 8,-4; 56 8,-3.5; 57 8,-3; 58 8,-2.5; 59 8,-2; 60 8,-1.5; 61 8,-1; 62 8,-0.5; 63 8,0; 64 8,0.5; 65 8,1; 66 8,1.5; 67 8,2; 68 8,2.5; 69 8,3; 70 8,3.5; 71 8,4; 72 8,4.5; 73 8,5; 74 8,5.5; 75 8,6 | smd 0.35 x 1.5: 26 -6,-8; 27 -5.5,-8; 28 -5,-8; 29 -4.5,-8; 30 -4,-8; 31 -3.5,-8; 32 -3,-8; 33 -2.5,-8; 34 -2,-8; 35 -1.5,-8; 36 -1,-8; 37 -0.5,-8; 38 0,-8; 39 0.5,-8; 40 1,-8; 41 1.5,-8; 42 2,-8; 43 2.5,-8; 44 3,-8; 45 3.5,-8; 46 4,-8; 47 4.5,-8; 48 5,-8; 49 5.5,-8; 50 6,-8; 76 6,8; 77 5.5,8; 78 5,8; 79 4.5,8; 80 4,8; 81 3.5,8; 82 3,8; 83 2.5,8; 84 2,8; 85 1.5,8; 86 1,8; 87 0.5,8; 88 0,8; 89 -0.5,8; 90 -1,8; 91 -1.5,8; 92 -2,8; 93 -2.5,8; 94 -3,8; 95 -3.5,8; 96 -4,8; 97 -4.5,8; 98 -5,8; 99 -5.5,8; 100 -6,8
SO-14DW = smd 0.6 x 2.2: 1 -3.81,-4.6; 2 -2.54,-4.6; 3 -1.27,-4.6; 4 0,-4.6; 5 1.27,-4.6; 6 2.54,-4.6; 7 3.81,-4.6; 8 3.81,4.6; 9 2.54,4.6; 10 1.27,4.6; 11 0,4.6; 12 -1.27,4.6; 13 -2.54,4.6; 14 -3.81,4.6
ESC64A = smd 2 x 2.4: 1 -2.3,0; 2 2.3,0
R0603 = smd 1 x 1.1: 1 -0.85,0; 2 0.85,0
SO08 = smd 0.6 x 2.2: 1 -1.905,-2.6; 2 -0.635,-2.6; 3 0.635,-2.6; 4 1.905,-2.6; 5 1.905,2.6; 6 0.635,2.6; 7 -0.635,2.6; 8 -1.905,2.6
DUMMY = drill 0.89 pad 1.25 offset: 1 7.11,-1.78; 2 6.09,0; 3 5.08,-1.78; 4 4.06,0; 5 3.05,-1.78; 6 2.03,0; 7 1.02,-1.78; 8 0,0
USB-MINIB = smd 2.5 x 0.5: D+ 2.5,0; D- 2.5,0.8; GND 2.5,-1.6; ID 2.5,-0.8; VBUS 2.5,1.6 | smd 2.5 x 2: GND@1 -3,-4.5; GND@2 -3,4.5; GND@3 2.5,4.5; GND@4 2.5,-4.5 | hole 0.9: 0,2.2; 0,-2.2
RJHSE5380 = drill 0.89 pad 1.25 offset: 1 7.11,-1.78; 2 6.09,0; 3 5.08,-1.78; 4 4.06,0; 5 3.05,-1.78; 6 2.03,0; 7 1.02,-1.78; 8 0,0 | drill 1.57 pad 2.8: SHIELD@1 -4.57,-0.89; SHIELD@2 11.69,-0.89 | hole 3.25: -2.79,-4.32; 9.91,-4.32

### Placement (x,y rotation side)
0.5  56.98,40.97 90 bottom
4  25.02,41.27 90 bottom
C1  45.22,96.82 96 top
C2  55.04,96.82 84 top
C3  64.65,94.78 72 top
C4  73.63,90.78 60 top
C5  81.58,85 48 top
C6  88.15,77.7 36 top
C7  93.07,69.19 24 top
C8  96.1,59.85 12 top
C9  97.13,50.08 0 top
C10  96.1,40.3 348 top
C11  93.07,30.96 336 top
C12  88.15,22.45 324 top
C13  81.58,15.15 312 top
C14  73.63,9.37 300 top
C15  64.65,5.38 288 top
C16  55.04,3.33 276 top
C17  45.22,3.33 264 top
C18  35.61,5.38 252 top
C19  26.63,9.37 240 top
C20  18.68,15.15 228 top
C21  12.11,22.45 216 top
C22  7.19,30.96 204 top
C23  4.16,40.3 192 top
C24  3.13,50.08 180 top
C25  4.16,59.85 168 top
C26  7.19,69.19 156 top
C27  12.11,77.7 144 top
C28  18.68,85 132 top
C29  26.63,90.78 120 top
C30  35.61,94.78 108 top
C31  50,91 90 top
C32  58.52,90.1 78 top
C33  66.68,87.46 66 top
C34  74.1,83.17 54 top
C35  80.47,77.43 42 top
C36  85.51,70.5 30 top
C37  88.99,62.67 18 top
C38  90.78,54.29 6 top
C39  90.78,45.71 354 top
C40  88.99,37.33 342 top
C41  85.51,29.5 330 top
C42  80.47,22.57 318 top
C43  74.1,16.83 306 top
C44  66.68,12.54 294 top
C45  58.52,9.9 282 top
C46  50,9 270 top
C47  41.48,9.9 258 top
C48  33.32,12.54 246 top
C49  25.9,16.83 234 top
C50  19.53,22.57 222 top
C51  14.49,29.5 210 top
C52  11.01,37.33 198 top
C53  9.22,45.71 186 top
C54  9.22,54.29 174 top
C55  11.01,62.67 162 top
C56  14.49,70.5 150 top
C57  19.53,77.43 138 top
C58  25.9,83.17 126 top
C59  33.32,87.46 114 top
C60  41.48,90.1 102 top
C61  57.57,78.52 180 bottom
C62  75,70.75 90 bottom
C63  74.5,59.25 90 bottom
C64  58.25,54 180 bottom
C65  52.5,70.5 270 bottom
C66  46.86,56.77 0 bottom
C67  64.49,33.79 270 bottom
C68  64.3,38.94 90 bottom
C69  63.5,44.45 90 bottom
C70  71.12,44.45 90 bottom
C71  66.4,71 180 top
C72  57.67,74.92 0 bottom
C73  66.41,69.04 180 top
C74  62,80 180 bottom
C75  65.44,80.01 0 bottom
C76  60,52 0 bottom
C77  77,61 270 bottom
C78  52.48,66.22 90 bottom
C79  48.54,49.34 0 bottom
C80  43.5,38 90 bottom
D1  67.41,39.17 0 bottom
D3  61.26,36.03 180 bottom
JP1  28.71,80.4 270 bottom
K1  30.48,20.95 90 bottom
L1  67.47,34.45 270 bottom
LDO  48.81,53.32 0 bottom
LED1  50,97 180 top
LED2  59.77,95.97 168 top
LED3  69.12,92.94 156 top
LED4  77.63,88.02 144 top
LED5  84.93,81.45 132 top
LED6  90.7,73.5 120 top
LED7  94.7,64.52 108 top
LED8  96.74,54.91 96 top
LED9  96.74,45.09 84 top
LED10  94.7,35.48 72 top
LED11  90.7,26.5 60 top
LED12  84.93,18.55 48 top
LED13  77.63,11.98 36 top
LED14  69.12,7.06 24 top
LED15  59.77,4.03 12 top
LED16  50,3 0 top
LED17  40.23,4.03 348 top
LED18  30.88,7.06 336 top
LED19  22.37,11.98 324 top
LED20  15.07,18.55 312 top
LED21  9.3,26.5 300 top
LED22  5.3,35.48 288 top
LED23  3.26,45.09 276 top
LED24  3.26,54.91 264 top
LED25  5.3,64.52 252 top
LED26  9.3,73.5 240 top
LED27  15.07,81.45 228 top
LED28  22.37,88.02 216 top
LED29  30.88,92.94 204 top
LED30  40.23,95.97 192 top
LED31  45.6,90.7 186 top
LED32  54.18,90.7 174 top
LED33  62.56,88.92 162 top
LED34  70.39,85.43 150 top
LED35  77.32,80.39 138 top
LED36  83.06,74.02 126 top
LED37  87.35,66.6 114 top
LED38  89.99,58.45 102 top
LED39  90.89,49.92 90 top
LED40  89.99,41.4 78 top
LED41  87.35,33.25 66 top
LED42  83.06,25.83 54 top
LED43  77.32,19.46 42 top
LED44  70.39,14.42 30 top
LED45  62.56,10.93 18 top
LED46  54.18,9.15 6 top
LED47  45.6,9.15 354 top
LED48  37.22,10.93 342 top
LED49  29.39,14.42 330 top
LED50  22.46,19.46 318 top
LED51  16.72,25.83 306 top
LED52  12.44,33.25 294 top
LED53  9.79,41.4 282 top
LED54  8.89,49.92 270 top
LED55  9.79,58.45 258 top
LED56  12.44,66.6 246 top
LED57  16.72,74.02 234 top
LED58  22.46,80.39 222 top
LED59  29.39,85.43 210 top
LED60  37.22,88.92 198 top
LTC4412  47.59,37.97 90 bottom
MCU  64,65 270 bottom
PUSHPULL  81.85,52.81 0 bottom
Q1_24MHZ  63.75,76.5 180 bottom
R1  80.6,61.2 180 bottom
R2  52.5,38 270 bottom
R3  81.3,65.7 180 bottom
R4  68.58,44.45 90 bottom
R5  66.04,44.45 90 bottom
R6  61.16,44.45 270 bottom
R7  30,57.4 180 top
R8  30,60.2 180 top
R9  29.9,67.7 180 top
T1  46.9,45.31 90 bottom
T2  32.14,45.31 270 bottom
U$1  54.26,29.89 0 bottom
X1  67.31,26.67 90 bottom
X2  54.26,19.5 0 bottom

### Tracks (layer width: path | path; a pad name or v marks a point on that pad's centre or on a via)
+3V3  (via drill 0.5, 0.6)  (1 unrouted)
  Top 0.254: v47.7,58.9 v52.5,63.7 | v52.5,63.7 52.4,63.8 50.8,63.8 46.8,67.8 v46.8,79.4 | v64,65 53.8,65 v52.5,63.7 | v64,65 64.52,65 67.25,67.73 C71.1 | C71.1 v68.7,71 | C71.1 C73.1 | v64,65 64,67.7 58.4,73.3 v58.4,76.6
  Bottom 0.254: C64.1 57.4,54.1 | MCU.75 58,55.4 57.4,54.8 57.4,54.1 | C63.1 74.1,58.4 73.5,59 MCU.50 70,59 v64,65 64.52,65 70.02,70.5 MCU.27 73.7,70.5 74.3,69.9 C62.1 | MCU.100 54.1,71 53.7,71.4 52.55,71.4 C65.1 52.45,71.3 50.3,71.3 49.2,70.2 49.2,67.4 51.23,65.37 C78.1 | 49.7,54.68 LDO.5 49.76,55.64 48.7,56.7 47.77,56.7 C66.1 | C78.1 52.5,65.35 v52.5,63.7 | C66.1 | 52.45,65.4 C78.1 | C66.1 47.71,58.59 v47.7,58.9 48,58.6 48.2,58.6 52.7,54.1 57.4,54.1 | JP1.2 JP1.1 32.59,81.6 35.3,81.6 37.5,79.4 v46.8,79.4 | v68.7,71 68.2,71 68,71.2 MCU.21 MCU.20 | MCU.6 60.5,74 59.58,74.92 C72.1 58.58,74.92 58.6,74.9 58.6,76.4 v58.4,76.6 58.42,76.62 C61.2 | MCU.11 63,73.7 62.1,74.6 60.6,74.6 59.5,75.7
+5V  (126 unrouted)
  Bottom 0.254: LDO.1 49.7,51.96 49.7,50.8 49.39,50.49 C79.1 49.39,50.31 48.9,50.8 48.2,50.8 47.9,51.1 47.9,51.98 LDO.3 44.02,52.02 44,52 | T1.2 T1.3
  Bottom 1.27: T2.3 T2.2 T1.3
  Bottom 2.54: T2.1 T2.2 34.74,49.96 34.6,50.1 34.6,50.5 34.7,50.6 | T1.1 T1.2
  pour Bottom: 32.4,55.3 43.3,55.3 43.3,50.6 32.4,50.6
D+
  Bottom 0.254: R6.1 C69.2 R5.2 66,45.34 66,49.3 60,55.3 MCU.71
D+_TMP
  Bottom 0.254: 67.02,33.55 L1.4 67,33.53 67,31.7 67.31,31.39 X1.D+
D-
  Bottom 0.254: C70.2 R4.2 68.6,45.32 68.6,47.6 60.5,55.7 MCU.70
D-_TMP
  Bottom 0.254: X1.D- 68.11,31.69 67.9,31.9 67.9,33.56 L1.1
DATA_IN_1_HIGH  (1 unrouted)
DATA_IN_1_LOW  (1 unrouted)
  Bottom 0.254: MCU.39 78.2,64.5 | 83.1,57.43 PUSHPULL.12
DATA_IN_2_HIGH  (1 unrouted)
DATA_IN_2_LOW  (1 unrouted)
  Bottom 0.254: MCU.41 78,63.5 | 79.2,57.52 PUSHPULL.9
GND  (via drill 0.5, 0.6)  (141 unrouted)
  Top 0.254: C73.2 C71.2 | v27.5,57.4 R7.2 R8.2
  Bottom 0.254: R6.2 C69.1 63.5,41.9 v63.6,41.8 | LTC4412.2 46.28,37.98 46.3,38 46.3,38.9 LTC4412.3 43.56,38.91 C80.2 43.5,40.4 v43.4,40.5 | MCU.74 58.5,55.4 59.1,54.8 C64.2 59.1,52.05 C76.2 v56.5,52 | MCU.49 73.5,59.5 74.1,60.1 C63.2 76.95,60.1 C77.2 76.9,60.05 76.9,59.1 75.9,58.1 v75.9,54.8 78.04,52.66 PUSHPULL.7 PUSHPULL.6 79.4,48.3 79.4,49.6 80,50.2 82.1,50.2 83.12,49.18 PUSHPULL.3 | MCU.26 73.7,71 74.3,71.6 C62.2 | C75.2 C74.2 | v50.3,68.2 51.35,68.2 51.38,68.17 | 51.38,68.17 C78.2 | 51.38,68.17 52.5,69.3 C65.2 53.25,69.65 54.1,70.5 MCU.99 57.4,70.5 v58.3,69.6 | MCU.10 62.5,72.2 61.9,71.6 58,71.6 56.9,72.7 56.9,74.84 C72.2 | 57.1,74.7 C72.2 | C72.2 57.2,74.8 57.2,74.9 v55.4,76.7 55.4,77.3 C61.1 | MCU.19 67,74.5 68.8,76.3 v68.8,76.8 | D1.2 67.41,38.3 66.9,38.8 65.02,38.8 C68.1 64.5,37.88 v64.5,36.4 v64.49,36.39 C67.1 65.71,33.42 X1.GND | LDO.2 48.8,52.7 48.2,53.3 46.8,53.3 46.01,54.09 C66.2 46.01,58.79 v45.9,58.9 | C79.2 47.36,49.34 v46.1,50.6 | v37.1,33.1 37.1,27.82 K1.2 | JP1.4 JP1.6 JP1.8 JP1.10 JP1.12 JP1.14 JP1.16 JP1.18 JP1.20 27.5,58.75 v27.5,57.4
JTCK
  Bottom 0.254: MCU.76 50.7,59 45.2,64.5 45.2,73.1 43.8,74.5 35.7,74.5 34.9,75.3 30.8,75.3 30.6,75.1 30.6,72 30.9,71.7 32.33,71.7 JP1.9
JTDI
  Bottom 0.254: MCU.77 51.2,59.5 45.8,64.9 45.8,73.3 43.9,75.2 36.2,75.2 34.8,76.6 JP1.5
JTDO
  Bottom 0.254: MCU.89 55,65.5 54.7,65.2 54.7,62.4 53.5,61.2 50.6,61.2 46.5,65.3 46.5,73.5 44.2,75.8 36.6,75.8 34.6,77.8 30.5,77.8 30.2,77.5 30.2,67.8 31.2,66.8 32.15,66.8 JP1.13
JTMS
  Bottom 0.254: MCU.72 59.5,57.8 59.2,58.1 50.8,58.1 44.5,64.4 44.5,73 43.5,74 32.57,74 JP1.7
N$1  (1 unrouted)
N$2  (1 unrouted)
N$3  (1 unrouted)
N$4  (1 unrouted)
N$5  (1 unrouted)
N$6  (1 unrouted)
N$7  (1 unrouted)
N$8  (1 unrouted)
N$9  (1 unrouted)
N$10  (1 unrouted)
N$11  (1 unrouted)
N$12  (1 unrouted)
N$13  (1 unrouted)
N$14  (1 unrouted)
N$15  (1 unrouted)
N$16  (1 unrouted)
N$17  (1 unrouted)
N$18  (1 unrouted)
N$19  (1 unrouted)
N$20  (1 unrouted)
N$21  (1 unrouted)
N$22  (1 unrouted)
N$23  (1 unrouted)
N$24  (1 unrouted)
N$25  (1 unrouted)
N$26  (1 unrouted)
N$27  (1 unrouted)
N$28  (1 unrouted)
N$29  (1 unrouted)
N$30  (1 unrouted)
N$31  (1 unrouted)
N$32  (1 unrouted)
N$33  (1 unrouted)
N$34  (1 unrouted)
N$35  (1 unrouted)
N$36  (1 unrouted)
N$37  (1 unrouted)
N$38  (1 unrouted)
N$39  (1 unrouted)
N$40  (1 unrouted)
N$41  (1 unrouted)
N$42  (1 unrouted)
N$43  (1 unrouted)
N$44  (1 unrouted)
N$45  (1 unrouted)
N$46  (1 unrouted)
N$47  (1 unrouted)
N$48  (1 unrouted)
N$49  (1 unrouted)
N$50  (1 unrouted)
N$51  (1 unrouted)
N$52  (1 unrouted)
N$53  (1 unrouted)
N$54
  Bottom 0.254: U$1.1 X2.1
N$55  (1 unrouted)
N$56  (1 unrouted)
N$57  (1 unrouted)
N$58  (1 unrouted)
N$59  (1 unrouted)
N$60  (1 unrouted)
N$61  (1 unrouted)
N$62
  Bottom 0.254: U$1.2 X2.2
N$63
  Bottom 0.254: LTC4412.5 47.84,37.97 47.3,38.4 47.3,39.8 45.5,41.6 35.5,41.6 34.8,42.7 34.8,43.35 T2.4
N$64
  Bottom 0.254: U$1.3 X2.3
N$65
  Bottom 0.254: L1.2 67.86,35.87 68.4,36.4 68.4,37.88 D1.1
N$66
  Bottom 0.254: L1.3 67.06,35.94 66.5,36.5 66.5,37.88 D1.3
N$67
  Bottom 0.254: D1.6 68.36,41.35 68.6,41.6 68.6,43.58 R4.1
N$68
  Bottom 0.254: D1.4 66.45,41.45 66.1,41.8 66.1,43.54 R5.1
N$69
  Bottom 0.254: 57.55,37.13 0.5.P$1
  Bottom 0.406: D3.1 57.55,37.13
N$70
  Bottom 0.254: U$1.4 X2.4
N$71
  Bottom 0.254: MCU.48 73,60 74.9,61.9 76.95,61.9 C77.1
N$72
  Bottom 0.254: MCU.73 59,55.6 60.9,53.7 60.9,52.05 C76.1
N$73
  Bottom 0.254: U$1.5 X2.5
N$74
  Bottom 0.254: U$1.6 X2.6
N$75
  Bottom 0.254: U$1.7 X2.7
N$76  (via drill 0.5)
  Top 0.254: v32.5,57.5 30.95,57.5 R7.1
  Bottom 0.254: JP1.19 32.52,57.52 v32.5,57.5
N$77  (via drill 0.5)
  Top 0.254: v32.5,60.1 30.95,60.1 R8.1
  Bottom 0.254: JP1.17 32.52,60.02 v32.5,60.1
N$78  (via drill 0.5)
  Top 0.254: v32.5,67.7 R9.1
  Bottom 0.254: JP1.11 32.52,67.82 v32.5,67.7
N$79
  Bottom 0.254: U$1.8 X2.8
NJTRST
  Bottom 0.254: MCU.90 54.8,66 53.9,65.2 53.9,62.4 53.2,61.7 50.9,61.7 47.1,65.5 47.1,73.8 44.5,76.4 36.9,76.4 34.1,79.2 32.59,79.2 JP1.3
NRSTIN
  Bottom 0.254: JP1.15 31.81,63.89 29.7,66 29.7,79 30.7,80 34.7,80 37.7,77 51.7,77 57.8,70.9 63.6,70.9 64.5,71.8 MCU.14
OSC_IN
  Bottom 0.254: C74.1 61.45,79.7 Q1_24MHZ.1 61.45,76.15 63.5,74.1 MCU.12
OSC_OUT
  Bottom 0.254: C75.1 66.29,76.74 Q1_24MHZ.2 66.05,76.15 64,74.1 MCU.13
PM_STATUS  (via drill 0.5, 0.6)
  Top 0.254: v44.3,48.4 47.3,48.4 60.8,61.9 66,61.9 71.5,67.4 71.5,73.6 v70,75.2
  Bottom 0.254: R2.1 48.95,38.85 LTC4412.4 48.88,39.62 47,41.4 47,46.2 46.1,47.2 44.31,47.2 T1.4 v44.3,48.4 | v70,75.2 69.7,75.2 69,74.6 MCU.23
V_5
  Bottom 0.254: LTC4412.1 43.63,37.02 C80.1 42.25,37.15 38.4,40.6 31.95,40.6 T2.5 | 29.39,44.52 T2.6
  Bottom 2.54: 4.P$2 29.39,44.52 | T2.5 T2.6 T2.7 T2.8
V_IN
  Bottom 2.54: K1.1 29.88,36.92 28.8,38 25.05,38 4.P$1
VBUS
  Bottom 0.254: 64.7,32.73 C67.2 | 61.3,34.89 D3.3
  Bottom 0.406: X1.VBUS 68.91,27.81 68.1,27 66,27 64.7,28.3 64.7,32.73 | C67.2 62.06,32.94 61.3,33.7 61.3,34.89
VBUS_S
  Bottom 0.254: D1.5 67.4,39.7 67,39.3 65.6,39.3 65.11,39.78 C68.2 64.28,39.8 59.3,39.8 56.98,42.12 0.5.P$2 55.59,44.22 | 49.52,44.7 T1.7 | T1.6 49.49,46.09 49.5,46.1 | T1.5
  Bottom 0.406: 55.59,44.22 55.1,44.7 49.52,44.7 | T1.6 T1.7 T1.8 | 49.5,46.1 T1.5

### Text on the board
Document: Kond.